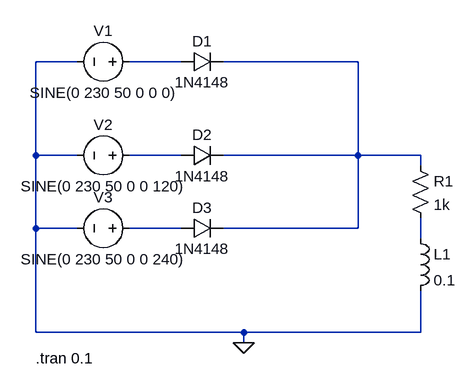
[diagram p0: schematic Lab2_14_02_2024_3_3PHRL.asc]
Lab2_14_02_2024_3_3PHRL.asc, the LTspice schematic file:
Version 4
SHEET 1 880 680
WIRE -32 0 -96 0
WIRE 128 0 48 0
WIRE 400 0 192 0
WIRE -96 144 -96 0
WIRE -32 144 -96 144
WIRE 128 144 48 144
WIRE 400 144 400 0
WIRE 400 144 192 144
WIRE 496 144 400 144
WIRE 496 160 496 144
WIRE -96 256 -96 144
WIRE -32 256 -96 256
WIRE 128 256 48 256
WIRE 400 256 400 144
WIRE 400 256 192 256
WIRE 496 272 496 240
WIRE -96 416 -96 256
WIRE 224 416 -96 416
WIRE 496 416 496 352
WIRE 496 416 224 416
WIRE 224 432 224 416
FLAG 224 432 0
SYMBOL voltage 64 0 R90
WINDOW 0 -32 56 VBottom 2
WINDOW 3 32 56 VTop 2
WINDOW 123 0 0 Left 0
WINDOW 39 0 0 Left 0
SYMATTR InstName V1
SYMATTR Value SINE(0 230 50 0 0 0)
SYMBOL diode 128 16 R270
WINDOW 0 32 32 VTop 2
WINDOW 3 0 32 VBottom 2
SYMATTR InstName D1
SYMATTR Value 1N4148
SYMBOL res 480 144 R0
SYMATTR InstName R1
SYMATTR Value 1k
SYMBOL voltage 64 144 R90
WINDOW 0 -32 56 VBottom 2
WINDOW 3 32 56 VTop 2
WINDOW 123 0 0 Left 0
WINDOW 39 0 0 Left 0
SYMATTR InstName V2
SYMATTR Value SINE(0 230 50 0 0 120)
SYMBOL voltage 64 256 R90
WINDOW 0 -32 56 VBottom 2
WINDOW 3 32 56 VTop 2
WINDOW 123 0 0 Left 0
WINDOW 39 0 0 Left 0
SYMATTR InstName V3
SYMATTR Value SINE(0 230 50 0 0 240)
SYMBOL diode 128 160 R270
WINDOW 0 32 32 VTop 2
WINDOW 3 0 32 VBottom 2
SYMATTR InstName D2
SYMATTR Value 1N4148
SYMBOL diode 128 272 R270
WINDOW 0 32 32 VTop 2
WINDOW 3 0 32 VBottom 2
SYMATTR InstName D3
SYMATTR Value 1N4148
SYMBOL ind 480 256 R0
SYMATTR InstName L1
SYMATTR Value 0.1
TEXT -96 456 Left 2 !.tran 0.1

The netlist it stands for:
* Lab2_14_02_2024_3_3PHRL.asc
V1 N001 0 SINE(0 230 50 0 0 0)
D1 N001 N002 1N4148
R1 N002 N005 1k
V2 N003 0 SINE(0 230 50 0 0 120)
V3 N004 0 SINE(0 230 50 0 0 240)
D2 N003 N002 1N4148
D3 N004 N002 1N4148
L1 N005 0 0.1
.model D D
.lib standard.dio
.tran 0.1
.backanno
.end